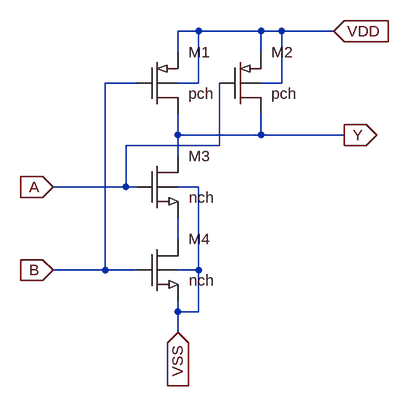
[diagram p0: schematic nand_min.asc]
nand_min.asc, the LTspice schematic file:
Version 4
SHEET 1 880 680
WIRE -144 -16 -176 -16
WIRE -48 -16 -144 -16
WIRE -16 -16 -48 -16
WIRE 64 -16 -16 -16
WIRE -176 16 -176 -16
WIRE -48 16 -48 -16
WIRE -240 64 -288 64
WIRE -144 64 -144 -16
WIRE -144 64 -176 64
WIRE -16 64 -16 -16
WIRE -16 64 -48 64
WIRE -176 144 -176 112
WIRE -48 144 -48 112
WIRE -48 144 -176 144
WIRE 80 144 -48 144
WIRE -112 160 -112 64
WIRE -112 160 -256 160
WIRE -176 176 -176 144
WIRE -256 224 -256 160
WIRE -256 224 -368 224
WIRE -240 224 -256 224
WIRE -144 224 -176 224
WIRE -176 304 -176 272
WIRE -288 352 -288 64
WIRE -288 352 -368 352
WIRE -240 352 -288 352
WIRE -144 352 -144 224
WIRE -144 352 -176 352
WIRE -176 416 -176 400
WIRE -144 416 -144 352
WIRE -144 416 -176 416
WIRE -176 448 -176 416
FLAG -368 224 A
IOPIN -368 224 In
FLAG -368 352 B
IOPIN -368 352 In
FLAG 80 144 Y
IOPIN 80 144 Out
FLAG 64 -16 VDD
IOPIN 64 -16 In
FLAG -176 448 VSS
IOPIN -176 448 In
SYMBOL MinedaLIB\\PMOS_MIN -240 64 R0
SYMATTR InstName M1
SYMATTR Value2 l=10.0U w=40.0U
SYMBOL MinedaLIB\\PMOS_MIN -112 64 R0
SYMATTR InstName M2
SYMATTR Value2 l=10.0U w=40.0U
SYMBOL MinedaLIB\\NMOS_MIN -240 224 R0
SYMATTR InstName M3
SYMATTR Value2 l=10.0U w=10.0U
SYMBOL MinedaLIB\\NMOS_MIN -240 352 R0
SYMATTR InstName M4
SYMATTR Value2 l=10.0U w=10.0U

The netlist it stands for:
* nand_min.asc
M1 Y B VDD VDD pch l=10.0U w=40.0U
M2 Y A VDD VDD pch l=10.0U w=40.0U
M3 Y A N001 VSS nch l=10.0U w=10.0U
M4 N001 B VSS VSS nch l=10.0U w=10.0U
.model NMOS NMOS
.model PMOS PMOS
.lib standard.mos
.backanno
.end